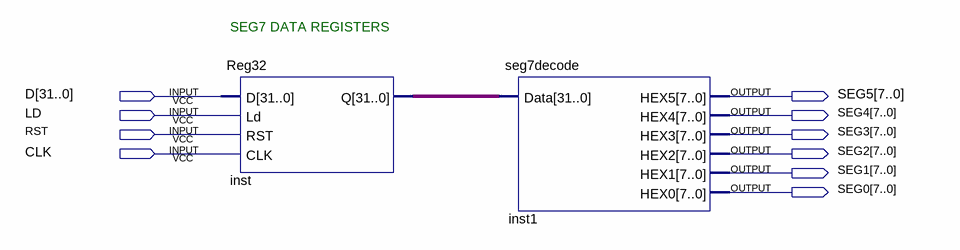
[diagram p0: schematic sheet]
// Quartus schematic Seg7.bdf as structural Verilog: 2 symbols, 10 pins
module Seg7 (
  input  [31:0] D,
  input  LD,
  input  RST,
  input  CLK,
  output [7:0] SEG5,
  output [7:0] SEG4,
  output [7:0] SEG3,
  output [7:0] SEG2,
  output [7:0] SEG1,
  output [7:0] SEG0
);

  wire [31:0] inst_q;

  Reg32 inst (.D(D), .Ld(LD), .RST(RST), .CLK(CLK), .Q(inst_q));
  seg7decode inst1 (.Data(inst_q), .HEX5(SEG5), .HEX4(SEG4), .HEX3(SEG3), .HEX2(SEG2), .HEX1(SEG1), .HEX0(SEG0));

  // Notes on the sheet:
  //   SEG7 DATA REGISTERS
endmodule
